# EAGLE design Central_Board (EAGLE 9.2.2)
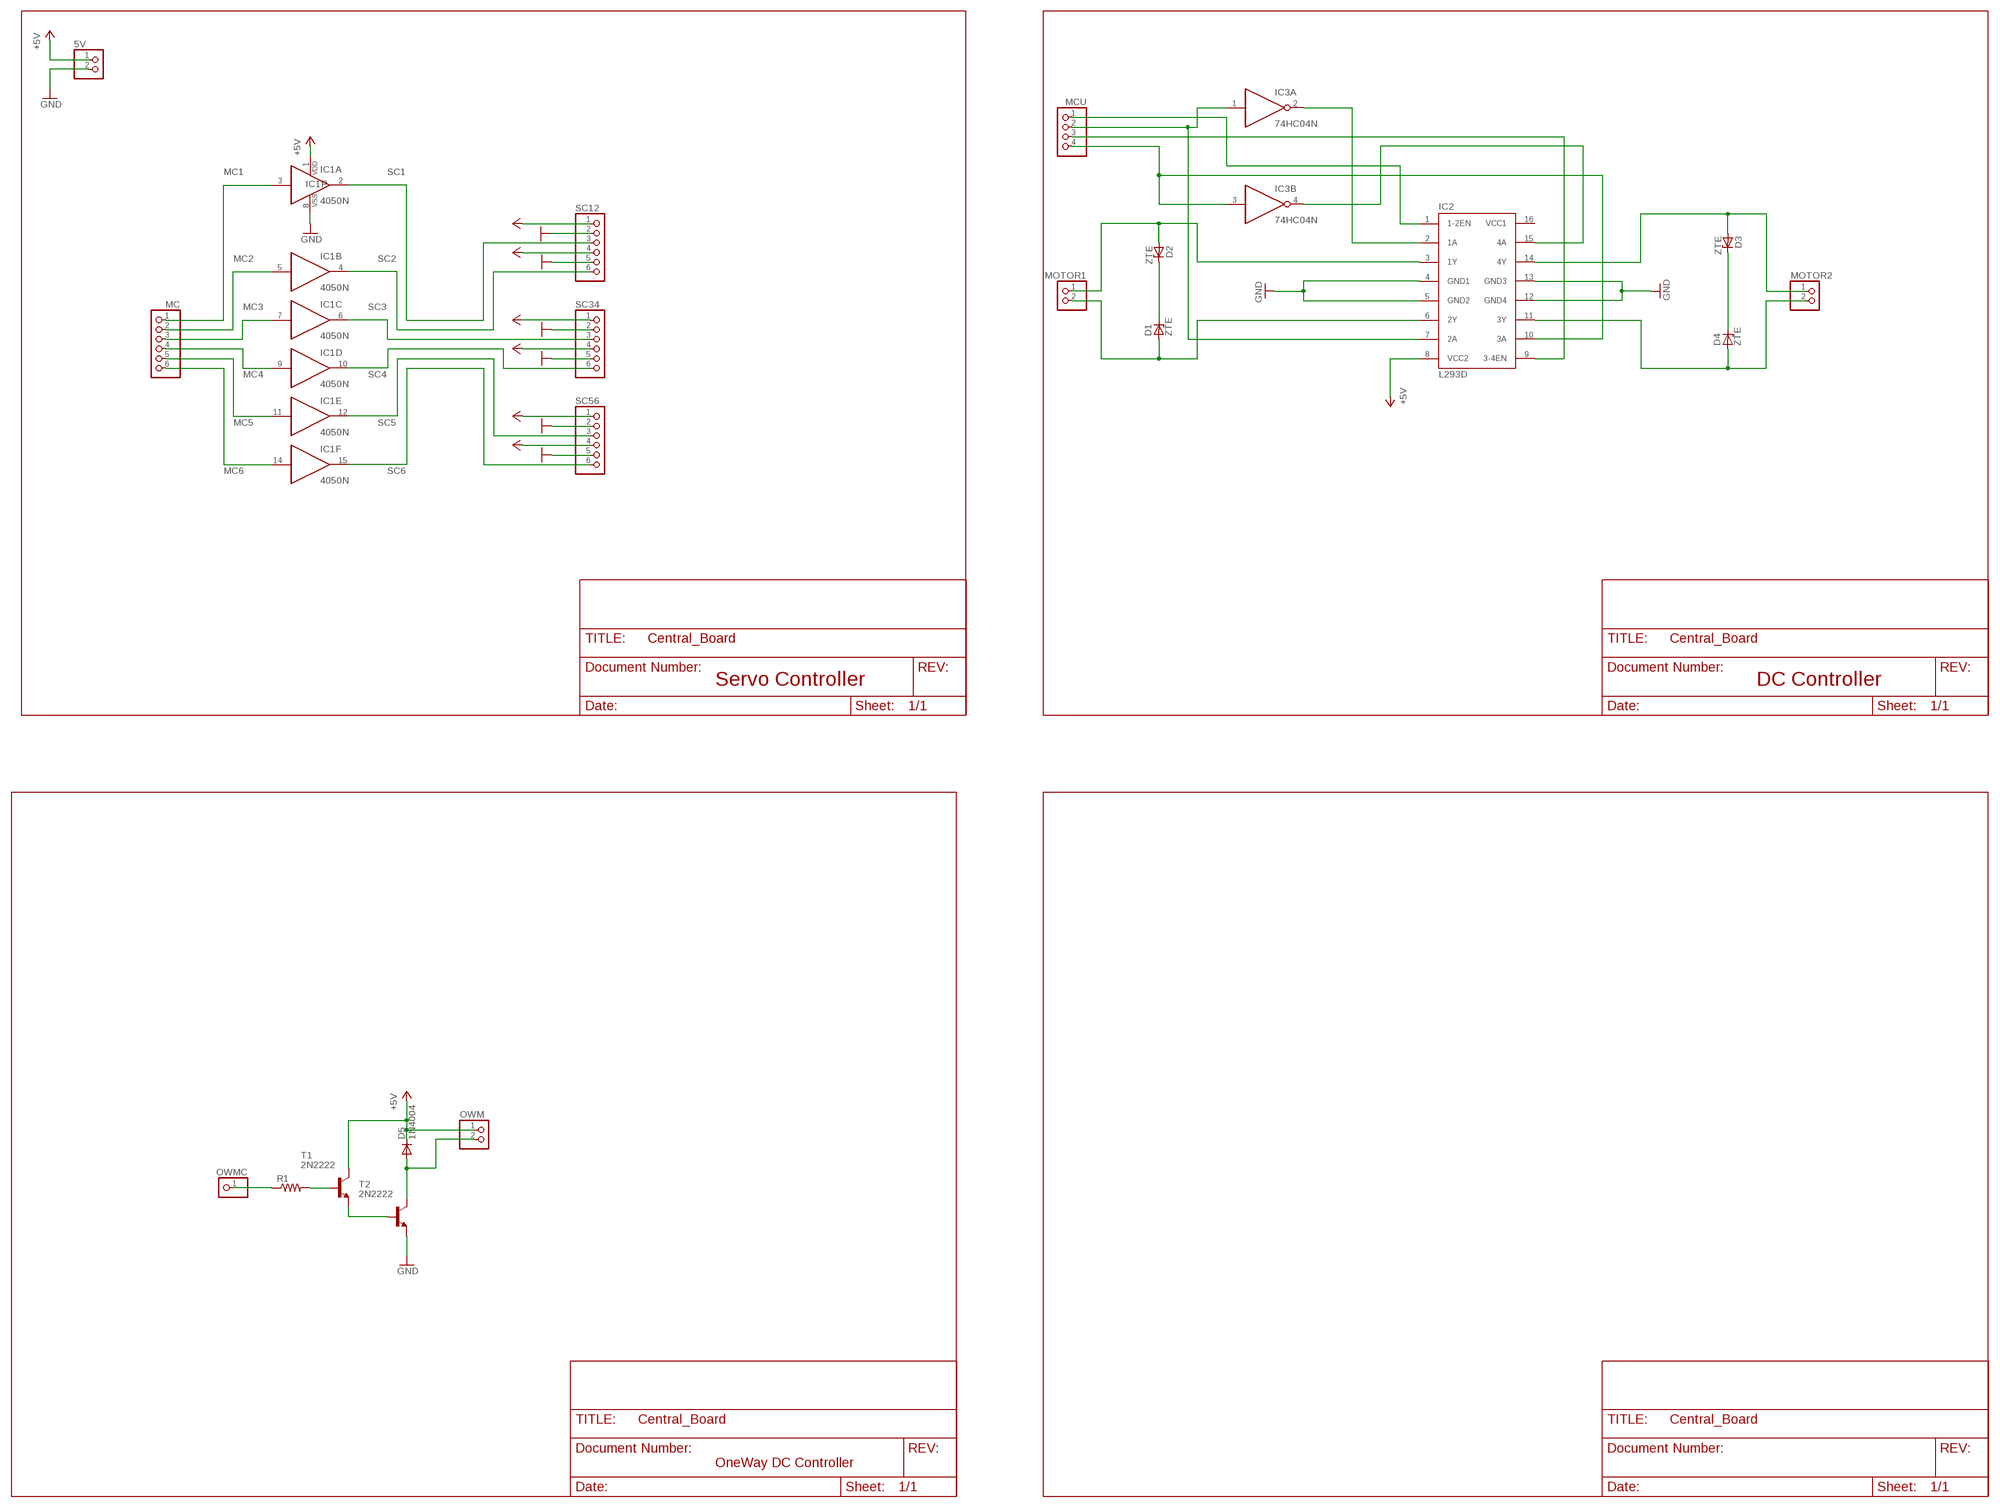
[diagram p0: schematic, sheet 1]

## Parts
5V  PINHD-1X2  [1X02]
D1  ZTE  [DO35Z10]
D2  ZTE  [DO35Z10]
D3  ZTE  [DO35Z10]
D4  ZTE  [DO35Z10]
D5  1N4004  [DO41-10]
IC1  4050N  [DIL16]
IC2  L293D  [DIL16]
IC3  74HC04N  [DIL14]
MC  PINHD-1X6  [1X06]
MCU  PINHD-1X4  [1X04]
MOTOR1  PINHD-1X2  [1X02]
MOTOR2  PINHD-1X2  [1X02]
OWM  PINHD-1X2  [1X02]
OWMC  PINHD-1X1  [1X01]
R1  R-US_0207/10  [0207/10]
SC12  PINHD-1X6  [1X06]
SC34  PINHD-1X6  [1X06]
SC56  PINHD-1X6  [1X06]
T1  2N2222  -NPN-TO92-ECB  [TO92-ECB]
T2  2N2222  -NPN-TO92-ECB  [TO92-ECB]

## Nets
+5V [PWR]: 5V.1 D5.C IC1.1(P:VDD) IC2.8(VCC2) OWM.1 SC12.1 SC12.4 SC34.1 SC34.4 SC56.1 SC56.4 T1.C
GND [PWR]: 5V.2 IC1.8(P:VSS) IC2.4(GND1) IC2.5(GND2) IC2.12(GND4) IC2.13(GND3) SC12.2 SC12.5 SC34.2 SC34.5 SC56.2 SC56.5 T2.E
MC1: IC1.3(A:I) MC.1
MC2: IC1.5(B:I) MC.2
MC3: IC1.7(C:I) MC.3
MC4: IC1.9(D:I) MC.4
MC5: IC1.11(E:I) MC.5
MC6: IC1.14(F:I) MC.6
N$1: D3.C D4.C
N$2: D3.A IC2.14(4Y) MOTOR2.1
N$3: D4.A IC2.11(3Y) MOTOR2.2
N$4: D2.A IC2.3(1Y) MOTOR1.1
N$5: D1.A IC2.6(2Y) MOTOR1.2
N$6: D1.C D2.C
N$7: IC2.2(1A) IC3.2(A:O)
N$8: D5.A OWM.2 T2.C
N$9: R1.2 T1.B
N$10: IC2.15(4A) IC3.4(B:O)
N$11: IC2.7(2A) IC3.1(A:I) MCU.2
N$12: IC2.10(3A) IC3.3(B:I) MCU.4
N$13: IC2.1(1-2EN) MCU.1
N$14 [PWR]: IC2.9(3-4EN) MCU.3
N$15: OWMC.1 R1.1
N$16: T1.E T2.B
SC1: IC1.2(A:O) SC12.3
SC2: IC1.4(B:O) SC12.6
SC3: IC1.6(C:O) SC34.3
SC4: IC1.10(D:O) SC34.6
SC5: IC1.12(E:O) SC56.3
SC6: IC1.15(F:O) SC56.6
Unconnected: IC3.5(C:I) IC3.6(C:O) IC3.8(D:O) IC3.9(D:I) IC3.10(E:O) IC3.11(E:I) IC3.12(F:O) IC3.13(F:I)

## Notes on the sheet
- Servo Controller | DC Controller
- OneWay DC Controller

## Power pins joined to a net without a drawn wire
GND: IC3.7(P:GND)
VCC: IC3.14(P:VCC)
VCC1: IC2.16(VCC1)

## Library data of the parts
5V MOTOR1 MOTOR2 OWM = pinhead:PINHD-1X2: PIN HEADER
D1-D4 = diode:ZTE: Z DIODE 300 mW
D5 = diode:1N4004: DIODE general purpose rectifier, 1 A
IC1 = 40xx:4050: Hex non-inverting BUFFER
IC2 = st-microelectronics:L293D: PUSH-PULL 4 CHANNEL DRIVER; MPN: L293D; OC_FARNELL: 9589619; OC_NEWARK: 56P8249
IC3 = 74xx-eu:74*04: Hex INVERTER
MC SC12 SC34 SC56 = pinhead:PINHD-1X6: PIN HEADER
MCU = pinhead:PINHD-1X4: PIN HEADER
OWMC = pinhead:PINHD-1X1: PIN HEADER
R1 = rcl:R-US_: RESISTOR, American symbol; SPICEPREFIX: R
T1 T2 = transistor:*-NPN-: NPN Transistror BF959 corrected 2008.03.06

## Net classes
0 default: width 0.635 mm
1 PWR: width 1.27 mm

## Board
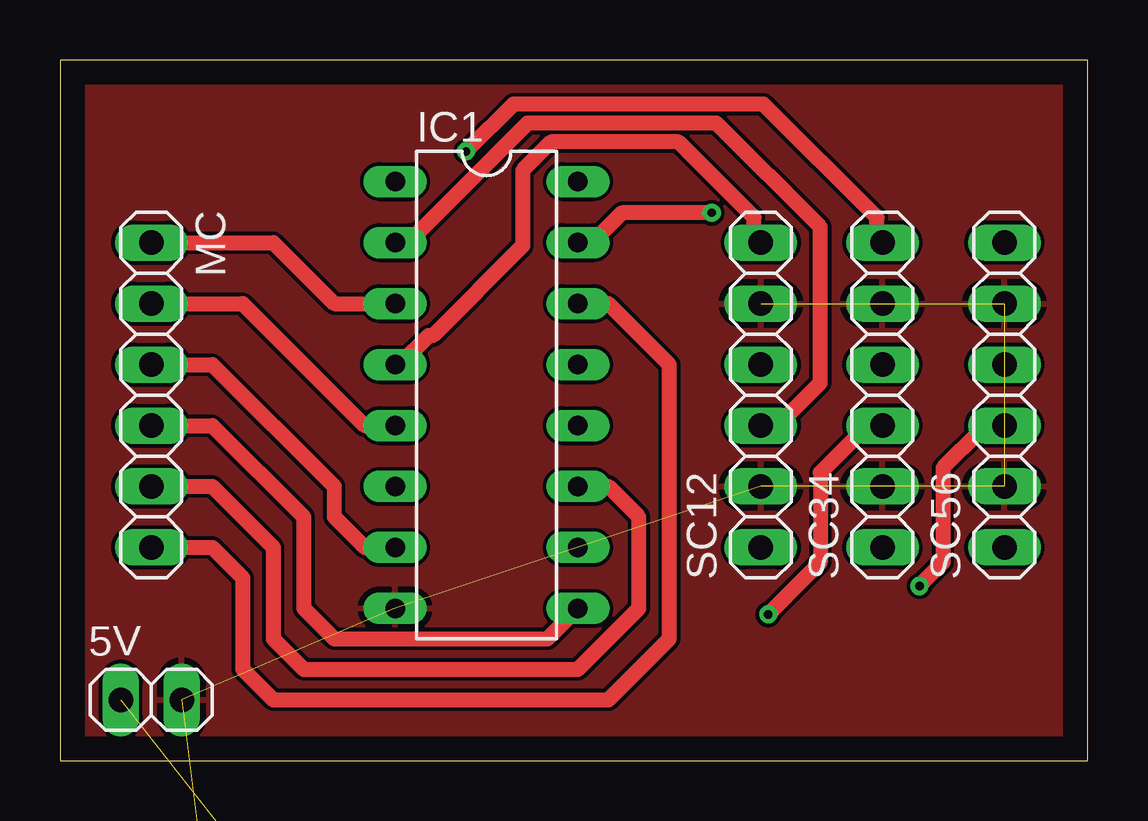
[diagram p1: board, top side]
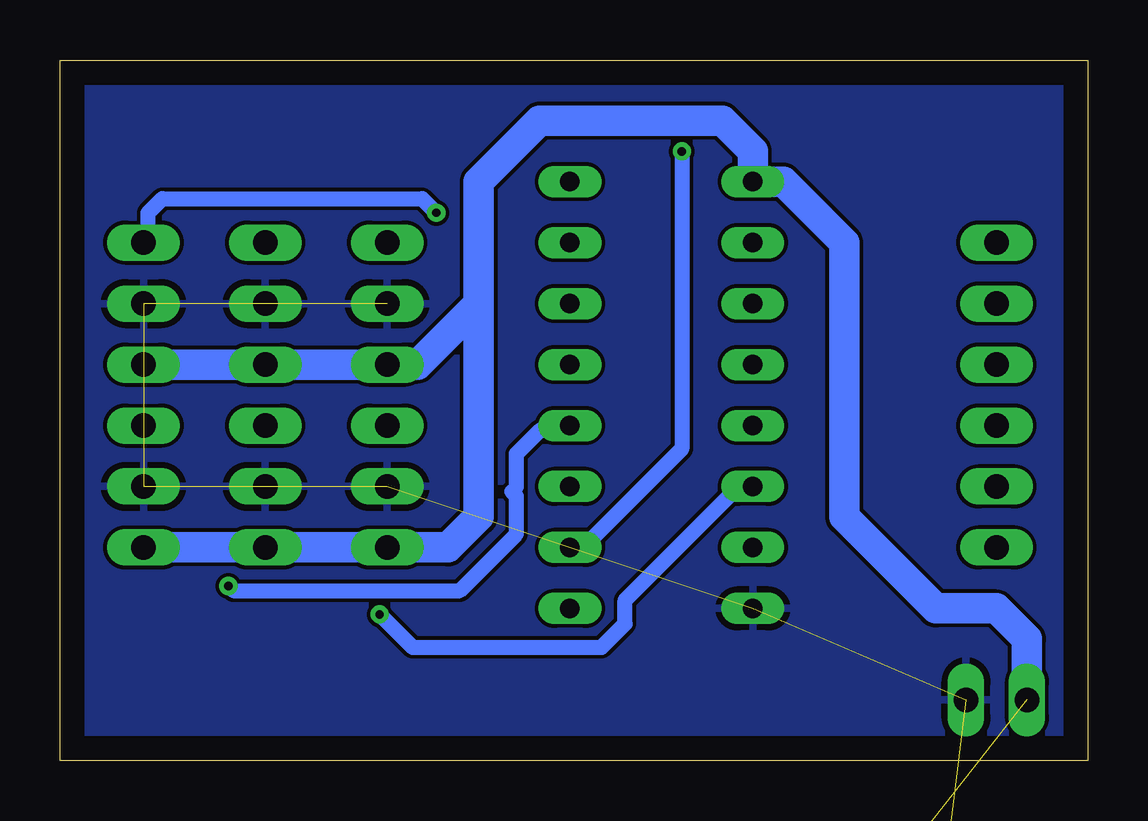
[diagram p2: board, bottom side, seen from below]

Size 42.85 x 29.2 mm. Coordinates in mm from the lower left corner, seen from the top.
Outline: 0,0 42.85,0 42.85,29.2 0,29.2 0,0
Copper layers (1*16): Top 0.035mm / dielectric 1.5mm / Bottom 0.035mm
Design rules "default": minimum track width 6mil, minimum drill 0.35mm, track to track 6mil, track to pad 6mil, pad to pad 6mil, via to via 6mil, smd to smd 6mil, copper to edge 40mil, drill to drill 6mil, minimum pad ring 10mil, minimum via ring 8mil, stop-mask expansion 4mil, vias tented up to drill 0mil, thermal gap 10mil

### Footprints (pad centres in the part's own frame; a part is rotated, then mirrored left to right if it is on the bottom)
1X02 = drill 1.016 long: 1 -1.27,0; 2 1.27,0
DO35Z10 = drill 0.813 long: A 5.08,0; C -5.08,0
DO41-10 = drill 1.118: A 5.08,0; C -5.08,0
DIL16 = drill 0.813 long: 1 -8.89,-3.81; 2 -6.35,-3.81; 3 -3.81,-3.81; 4 -1.27,-3.81; 5 1.27,-3.81; 6 3.81,-3.81; 7 6.35,-3.81; 8 8.89,-3.81; 9 8.89,3.81; 10 6.35,3.81; 11 3.81,3.81; 12 1.27,3.81; 13 -1.27,3.81; 14 -3.81,3.81; 15 -6.35,3.81; 16 -8.89,3.81
DIL14 = drill 0.813 long: 1 -7.62,-3.81; 2 -5.08,-3.81; 3 -2.54,-3.81; 4 0,-3.81; 5 2.54,-3.81; 6 5.08,-3.81; 7 7.62,-3.81; 8 7.62,3.81; 9 5.08,3.81; 10 2.54,3.81; 11 0,3.81; 12 -2.54,3.81; 13 -5.08,3.81; 14 -7.62,3.81
1X06 = drill 1.016 long: 1 -6.35,0; 2 -3.81,0; 3 -1.27,0; 4 1.27,0; 5 3.81,0; 6 6.35,0
1X04 = drill 1.016 long: 1 -3.81,0; 2 -1.27,0; 3 1.27,0; 4 3.81,0
1X01 = drill 1.016 octagon: 1 0,0
0207/10 = drill 0.813 octagon: 1 -5.08,0; 2 5.08,0
TO92-ECB = drill 0.813 long: B 2.54,0; C 0,0; E -2.54,0

### Placement (x,y rotation side)
5V  3.81,2.54 0 top
D1  1.27,-33.02 0 top  (outside the outline)
D2  1.27,-39.37 0 top  (outside the outline)
D3  1.27,-45.72 0 top  (outside the outline)
D4  1.27,-52.07 0 top  (outside the outline)
D5  1.27,-97.79 0 top  (outside the outline)
IC1  17.78,15.24 270 top
IC2  7.62,-11.43 0 top  (outside the outline)
IC3  6.35,-67.31 0 top  (outside the outline)
MC  3.81,15.24 270 top
MCU  0,-59.69 0 top  (outside the outline)
MOTOR1  -2.54,-27.94 0 top  (outside the outline)
MOTOR2  -2.54,-21.59 0 top  (outside the outline)
OWM  -2.54,-86.36 0 top  (outside the outline)
OWMC  -3.81,-92.71 0 top  (outside the outline)
R1  -17.78,-105.41 0 top  (outside the outline)
SC12  29.21,15.24 90 top
SC34  34.29,15.24 90 top
SC56  39.37,15.24 90 top
T1  -11.43,-96.52 0 top  (outside the outline)
T2  -20.32,-96.52 0 top  (outside the outline)

### Tracks (layer width: path | path; a pad name or v marks a point on that pad's centre or on a via)
+5V  (4 unrouted)
  Bottom 1.27: 5V.1 2.54,5.08 3.81,6.35 6.35,6.35 10.16,10.16 10.16,21.59 12.7,24.13 IC1.1 13.97,25.4 15.24,26.67 22.86,26.67 25.4,24.13 25.4,19.05 | SC56.4 SC34.4 SC12.4 27.94,16.51 25.4,19.05 | SC56.1 SC34.1 SC12.1 26.67,8.89 25.4,10.16 25.4,19.05
GND  (13 unrouted)
  pour Top: 0,29.21 41.91,29.21 41.91,0 0,0
  pour Bottom: 0,29.21 41.91,29.21 41.91,0 0,0
MC1
  Top 0.635: MC.1 8.89,21.59 11.43,19.05 IC1.3
MC2
  Top 0.635: MC.2 7.62,19.05 12.7,13.97 IC1.5
MC3
  Top 0.635: MC.3 6.35,16.51 11.43,11.43 11.43,10.16 12.7,8.89 IC1.7
MC4
  Top 0.635: MC.4 6.35,13.97 10.16,10.16 10.16,6.35 11.43,5.08 20.32,5.08 IC1.9
MC5
  Top 0.635: MC.5 6.35,11.43 8.89,8.89 8.89,5.08 10.16,3.81 21.59,3.81 24.13,6.35 24.13,10.16 22.86,11.43 IC1.11
MC6
  Top 0.635: MC.6 6.35,8.89 7.62,7.62 7.62,3.81 8.89,2.54 22.86,2.54 25.4,5.08 25.4,16.51 22.86,19.05 IC1.14
N$1  (1 unrouted)
N$2  (2 unrouted)
N$3  (2 unrouted)
N$4  (2 unrouted)
N$5  (2 unrouted)
N$6  (1 unrouted)
N$7  (1 unrouted)
N$8  (2 unrouted)
N$9  (1 unrouted)
N$10  (1 unrouted)
N$11  (2 unrouted)
N$12  (2 unrouted)
N$13  (1 unrouted)
N$14  (1 unrouted)
N$15  (1 unrouted)
N$16  (1 unrouted)
SC1
  Top 0.635: IC1.2 13.98,21.65 14.57,21.65 19.49,26.57 27.36,26.57 31.69,22.24 31.69,15.75 29.92,13.98 29.33,13.98 SC12.3
SC2
  Top 0.635: IC1.4 13.98,16.54 14.17,16.54 15.35,17.72 15.55,17.72 19.29,21.46 19.29,24.61 20.47,25.79 25.79,25.79 28.94,22.64 28.94,21.85 29.13,21.65 SC12.6
SC3  (via drill 0.35)
  Top 0.635: v29.53,6.1 31.69,8.27 31.69,12.01 33.47,13.78 34.25,13.78 SC34.3
  Bottom 0.635: v29.53,6.1 28.15,4.72 20.28,4.72 19.29,5.71 19.29,6.69 14.57,11.42 13.98,11.42 IC1.6
SC4  (via drill 0.35)
  Top 0.635: v16.93,25.39 18.9,27.36 29.33,27.36 34.05,22.64 34.05,21.85 34.25,21.65 SC34.6
  Bottom 0.635: v16.93,25.39 16.93,12.99 20.87,9.05 21.46,9.05 IC1.10
SC5  (via drill 0.35)
  Top 0.635: v35.83,7.28 36.81,8.27 36.81,12.21 38.39,13.78 39.37,13.78 SC56.3
  Bottom 0.635: v35.83,7.28 35.63,7.09 26.18,7.09 23.82,9.45 23.82,11.02 24.02,11.22 23.82,11.42 23.82,12.79 22.84,13.78 21.65,13.78 IC1.12
SC6  (via drill 0.35)
  Top 0.635: v27.16,22.84 23.43,22.84 22.24,21.65 21.65,21.65 IC1.15
  Bottom 0.635: v27.16,22.84 27.76,23.43 38.58,23.43 39.17,22.84 39.17,21.85 39.37,21.65 SC56.6